# Altium schematic sheet QSPI.SchDoc: QSPI
size A4; Date: 9/24/2014; Author: P.A.; CompanyName: STMicroelectronics; Organization: Microcontrollers Division; Address1: 12, Rue Jules HOROWITZ; Address2: 38019 Grenoble; Address3: FRANCE; DocumentNumber: MB1209; Revision: D-02; SheetNumber: 5; SheetTotal: 11; Project: STM32F412G-DISCO; ModifiedDate: 6/2/2016
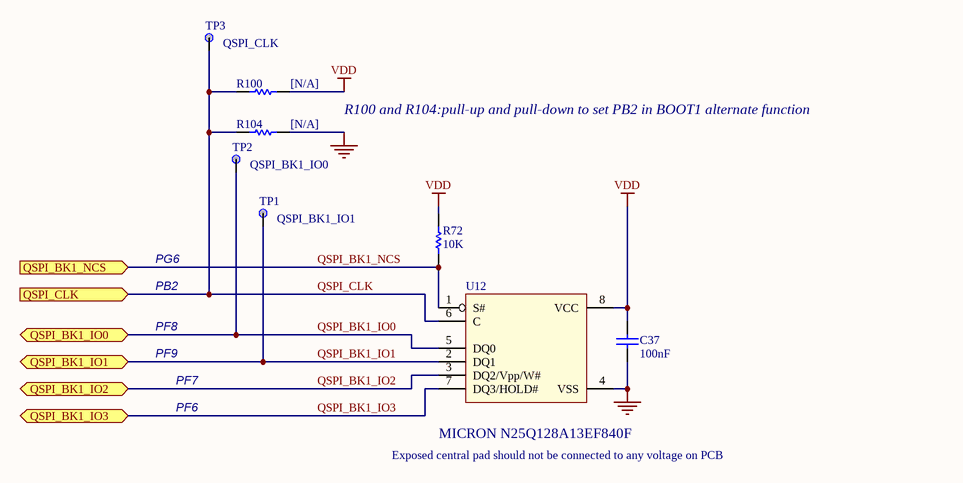
[diagram p0: QSPI.SchDoc]

## Parts
C37  100nF  [0402C]
R72  10K  [0402R]
R100  [N/A]  [0603R]
R104  [N/A]  [0603R]
TP1  TP Name: QSPI_BK1_IO1  [TP_C40]  (hidden comment: TP)
TP2  TP Name: QSPI_BK1_IO0  [TP_C40]  (hidden comment: TP)
TP3  TP Name: QSPI_CLK  [TP_C40]  (hidden comment: TP)
U12  MICRON N25Q128A13EF840F  [DFN8_1R27_6X8_TP4R8X5R8]

## Ports
QSPI_BK1_IO0 (bidir), QSPI_BK1_IO1 (bidir), QSPI_BK1_IO2 (bidir), QSPI_BK1_IO3 (bidir), QSPI_BK1_NCS (in), QSPI_CLK (in)

## Nets
GND: C37.2 R104.1 U12.4(VSS)
VDD: C37.1 R72.2 R100.1 U12.8(VCC)
QSPI_BK1_IO0: TP2.1 U12.5(DQ0) ; port QSPI_BK1_IO0
QSPI_BK1_IO1: TP1.1 U12.2(DQ1) ; port QSPI_BK1_IO1
QSPI_BK1_IO2: U12.3(DQ2/Vpp/W#) ; port QSPI_BK1_IO2
QSPI_BK1_IO3: U12.7(DQ3/HOLD#) ; port QSPI_BK1_IO3
QSPI_BK1_NCS: R72.1 U12.1(S#) ; port QSPI_BK1_NCS
QSPI_CLK: R100.2 R104.2 TP3.1 U12.6(C) ; port QSPI_CLK

## Notes on the sheet
- R100 and R104:pull-up and pull-down to set PB2 in BOOT1 alternate function
- PG6
- PB2
- PF8
- PF9
- PF7
- PF6
- Exposed central pad should not be connected to any voltage on PCB
- Title:
- Project:
- Size:
- Date:
- A4
- Reference:
- Sheet:
- Revision:
- of

## Library data of the parts
C37 = Cap: Capacitor; Value: 10nF; Ordered by: Subcon; ECCN_US/EU: NA; Published: 8-Jun-2000; Revision: July-2002: Re-released for DXP Platform.; Publisher: Altium Limited
R72 = Res_10K_1%_0402: Resistor; Manuf_Part_1: RC0402FR-0710KL; Manuf_1: YAGEO; ECCN_US/EU: NA; Ordered by: Subcon; Value: 10K; Order: RC0402FR-0710KL
R100 R104 = Res1: Resistor; Value: 1K; Ordered by: Subcon; Fitted: NO; ECCN_US/EU: NA; Published: 8-Jun-2000; Revision: July-2002: Re-released for DXP Platform.; Publisher: Altium Limited
TP1-TP3 = TP: Ordered by: Subcon; ECCN_US/EU: NA
U12 = N25Q128A13EF840E: 128Mb, 3V, Multiple I/O Serial Flash Memory, Quad/Dual; Manuf_Part_2: N25Q256A13EF840E; Manuf_Part_3: N25Q512A13EF840E; ECCN_US/EU: 3A991/NEC; Order: N25Q128A13EF840F-ND; Ordered by: ST; Ref St: 9171973; Manuf_Part_1: N25Q128A13EF840E; Manuf_1: MICRON; Distrib: DIGIKEY